# Altium schematic sheet 09_PHTest.SchDoc
size A4
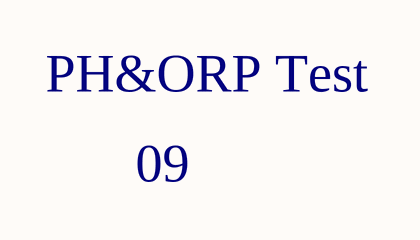
[diagram p0: 09_PHTest.SchDoc]

## Notes on the sheet
- PH&ORP Test
- 09